# Altium project mach_sac_Project.PrjPcb
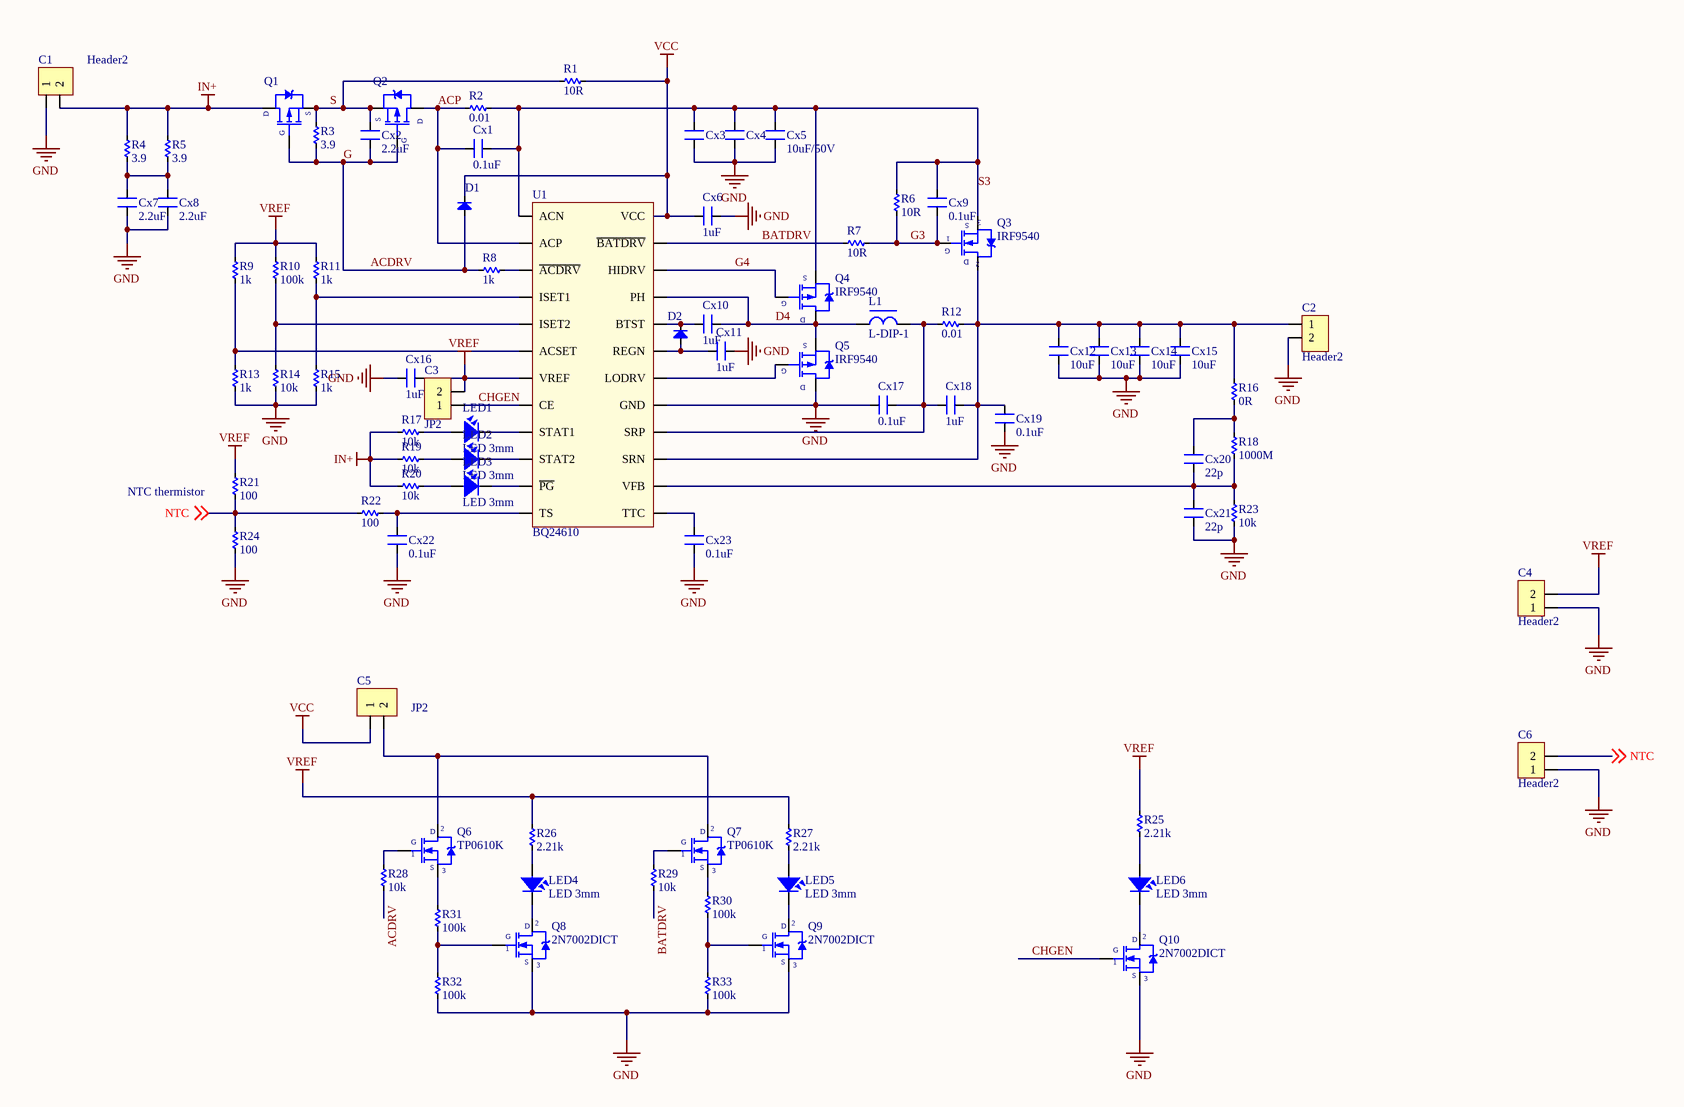
[diagram p0: mach sac.SchDoc]
1 sheet, 82 parts. Net scope: global (net labels, ports and power ports of the same name join across sheets).
Board file: mach sac.PcbDoc

## Sheet mach sac.SchDoc
size A3

### Parts
C1  Header2  [HDR2]
C2  Header2  [HDR2]
C3  JP2  [JP2-CLOSED]
C4  Header2  [HDR2]
C5  JP2  [JP2-C1T]
C6  Header2  [HDR2]
Cx1  0.1uF  [C0805]
Cx2  2.2uF  [C0805]
Cx3  10uF/50V  [C0805]  (value not drawn)
Cx4  10uF/50V  [C0805]  (value not drawn)
Cx5  10uF/50V  [C0805]
Cx6  1uF  [C0805]
Cx7  2.2uF  [C0805]
Cx8  2.2uF  [C0805]
Cx9  0.1uF  [C0805]
Cx10  1uF  [C0805]
Cx11  1uF  [C0805]
Cx12  10uF  [C0805]
Cx13  10uF  [C0805]
Cx14  10uF  [C0805]
Cx15  10uF  [C0805]
Cx16  1uF  [C0805]
Cx17  0.1uF  [C0805]
Cx18  1uF  [C0805]
Cx19  0.1uF  [C0805]
Cx20  22p  [C0805]
Cx21  22p  [C0805]
Cx22  0.1uF  [C0805]
Cx23  0.1uF  [C0805]
D1  Diode  [DIO-1A]  (value not drawn)
D2  Diode  [DIO-1A]  (value not drawn)
L1  L-DIP-1  [L-SMD-D-12.5x12.5]
LED1  LED 3mm  [Led SMD]
LED2  LED 3mm  [Led SMD]
LED3  LED 3mm  [Led SMD]
LED4  LED 3mm  [Led SMD]
LED5  LED 3mm  [Led SMD]
LED6  LED 3mm  [Led SMD]
Q1  IRF9540  [SO-8]  (value not drawn)
Q2  IRF9540  [SO-8]  (value not drawn)
Q3  IRF9540  [SO-8]
Q4  IRF9540  [SO-8]
Q5  IRF9540  [SO-8]
Q6  TP0610K  [SOT23-132]
Q7  TP0610K  [SOT23-132]
Q8  2N7002DICT  [SOT23-132]
Q9  2N7002DICT  [SOT23-132]
Q10  2N7002DICT  [SOT23-132]
R1  10R  [RES-SMD-0805]
R2  0.01  [RES-SMD-1210]
R3  3.9  [RES-SMD-0805]
R4  3.9  [RES-SMD-0805]
R5  3.9  [RES-SMD-0805]
R6  10R  [RES-SMD-0805]
R7  10R  [RES-SMD-0805]
R8  1k  [RES-SMD-0805]
R9  1k  [RES-SMD-0805]
R10  100k  [RES-SMD-0805]
R11  1k  [RES-SMD-0805]
R12  0.01  [RES-SMD-1210]
R13  1k  [RES-SMD-0805]
R14  10k  [RES-SMD-0805]
R15  1k  [RES-SMD-0805]
R16  0R  [RES-SMD-0805]
R17  10k  [RES-SMD-0805]
R18  1000M  [RES-SMD-0805]
R19  10k  [RES-SMD-0805]
R20  10k  [RES-SMD-0805]
R21  100  [RES-SMD-0805]
R22  100  [RES-SMD-0805]
R23  10k  [RES-SMD-0805]
R24  100  [RES-SMD-0805]
R25  2.21k  [RES-SMD-0603]
R26  2.21k  [RES-SMD-0603]
R27  2.21k  [RES-SMD-0603]
R28  10k  [RES-SMD-0603]
R29  10k  [RES-SMD-0603]
R30  100k  [RES-SMD-0603]
R31  100k  [RES-SMD-0603]
R32  100k  [RES-SMD-0603]
R33  100k  [RES-SMD-0603]
U1  BQ24610  [QFN50P400X400X100_HS-25N]

### Nets
GND: C1.1 C2.2 C4.1 C6.1 Cx3.2 Cx4.2 Cx5.2 Cx6.1 Cx7.1 Cx8.1 Cx11.1 Cx12.2 Cx13.2 Cx14.2 Cx15.2 Cx16.1 Cx17.2 Cx19.2 Cx21.2 Cx22.2 Cx23.2 Q5.2(D) Q8.3(S) Q9.3(S) Q10.3(S) R13.1 R14.1 R15.1 R23.2 R24.1 R32.2 R33.2 U1.17(GND)
IN+: C1.2 Q1.2(D) R4.1 R5.1 R17.2 R19.2 R20.2
VCC: C5.1 Cx6.2 D1.2(K) R1.2 U1.24(VCC)
VREF: C3.2 C4.2 Cx16.2 R9.2 R10.2 R11.2 R21.2 R25.1 R26.1 R27.1 U1.10(VREF)
ACDRV: Cx2.1 D1.1(A) Q1.1(G) Q2.1(G) R3.2 R8.1 R28.2  [also labelled G]
ACP: Cx1.2 Q2.2(D) R2.2 U1.2(ACP)
BATDRV: R7.1 R29.2 U1.23(~{BATDRV})
CHGEN: C3.1 Q10.1(G) U1.4(CE)
D4: Cx10.1 L1.1 Q4.2(D) Q5.3(S) U1.20(PH)
G3: Cx9.2 Q3.1(G) R6.1 R7.2
G4: Q4.1(G) U1.21(HIDRV)
NTC: C6.2 R21.1 R22.1 R24.2 ; off-sheet NTC
S: Cx2.2 Q1.3(S) Q2.3(S) R1.1 R3.1
S3: Cx1.1 Cx3.1 Cx4.1 Cx5.1 Cx9.1 Q3.3(S) Q4.3(S) R2.1 R6.2 U1.1(ACN)
NetC2_1: C2.1 Cx12.1 Cx13.1 Cx14.1 Cx15.1 Cx18.1 Cx19.1 Q3.2(D) R12.1 R16.1 U1.13(SRN)
NetC5_2: C5.2 Q6.2(D) Q7.2(D)
NetCx7_2: Cx7.2 Cx8.2 R4.2 R5.2
NetCx10_2: Cx10.2 D2.2(K) U1.22(BTST)
NetCx11_2: Cx11.2 D2.1(A) U1.18(REGN)
NetCx17_1: Cx17.1 Cx18.2 L1.2 R12.2 U1.14(SRP)
NetCx20_1: Cx20.1 R16.2 R18.1
NetCx20_2: Cx20.2 Cx21.1 R18.2 R23.1 U1.12(VFB)
NetCx22_1: Cx22.1 R22.2 U1.6(TS)
NetCx23_1: Cx23.1 U1.7(TTC)
NetLED1_1: LED1.1 R17.1
NetLED1_2: LED1.2 U1.5(STAT1)
NetLED2_1: LED2.1 R19.1
NetLED2_2: LED2.2 U1.9(STAT2)
NetLED3_1: LED3.1 R20.1
NetLED3_2: LED3.2 U1.8(~{PG})
NetLED4_1: LED4.1 R26.2
NetLED4_2: LED4.2 Q8.2(D)
NetLED5_1: LED5.1 R27.2
NetLED5_2: LED5.2 Q9.2(D)
NetLED6_1: LED6.1 R25.2
NetLED6_2: LED6.2 Q10.2(D)
NetQ5_1: Q5.1(G) U1.19(LODRV)
NetQ6_1: Q6.1(G) R28.1
NetQ6_3: Q6.3(S) R31.1
NetQ7_1: Q7.1(G) R29.1
NetQ7_3: Q7.3(S) R30.1
NetQ8_1: Q8.1(G) R31.2 R32.1
NetQ9_1: Q9.1(G) R30.2 R33.1
NetR8_2: R8.2 U1.3(~{ACDRV})
NetR9_1: R9.1 R13.2 U1.16(ACSET)
NetR10_1: R10.1 R14.2 U1.15(ISET2)
NetR11_1: R11.1 R15.2 U1.11(ISET1)

### Notes on the sheet
- (near R21) NTC thermistor

### Library data of the parts
C1 C2 C4 C6 = Header2: Header IDC, 2 x 1 Pin Vertical 2.54mm Pitch (Non-Boxed, Male); Manufacturer: W¨¹rth Elektronik eiSos GmbH; partNo: 613002143121; ComponentLink1 Description: Manufacturer; ComponentLink2 Description: Datasheet; NoPins: 02; Created Date: 29 March 2013; ComponentLink1URL: http://www.we-online.com; ComponentLink2URL: http://katalog.we-online.de/em/datasheet/6130xx143121.pdf; Created by: Karrer Zheng
C3 C5 = JP2: WR-PHD 2.54 mm Angled Socket Header; Manufacturer: W¨¹rth Elektronik eiSos GmbH; partNo: 613002143121; ComponentLink1 Description: Manufacturer; ComponentLink2 Description: Datasheet; NoPins: 02; Created Date: 29 March 2013; ComponentLink1URL: http://www.we-online.com; ComponentLink2URL: http://katalog.we-online.de/em/datasheet/6130xx143121.pdf; Created by: Karrer Zheng
Cx1-Cx23 = CN: Value: 33pF
D1 D2 = Diode: Default Diode; Code - JEDEC: DO-214-AB; Value: 1N5007; Published: 8-Jun-2000; Revision: July-2002: Re-released for DXP Platform.; Publisher: Altium Limited
L1 = L-DIP-1: Inductor; Value: 150 mH
LED1-LED6 = LED 3mm: LED Single colour Green and Red; Value: LED 3 ly Single Colour
Q1 = IRF9540: HEXFET P-Channel Power MOSFET; Note: Pin 2 is electrically connected to pin 4.; Published: 8-Jun-2000; LatestRevisionDate: 17-Jul-2002; LatestRevisionNote: Re-released for DXP Platform.; DatasheetVersion: PD-9.421C; PackageVersion: Feb-1997; PackageReference: TO-220AB; Publisher: Altium Limited; PackageDescription: TO, Thru-Hole, Vertical, Heatsink Mounted; 3 In-Line Leads; Pitch 2.54 mm; ComponentLink1Description: Manufacturer Link; ComponentLink1URL: http://www.irf.com/; ComponentLink2Description: Datasheet; ComponentLink2URL: http://www.irf.com/product-info/datasheets/data/irf9540.pdf
Q2 = IRF840: HEXFET P-Channel Power MOSFET; Note: Pin 2 is electrically connected to pin 4.; Published: 8-Jun-2000; LatestRevisionDate: 17-Jul-2002; LatestRevisionNote: Re-released for DXP Platform.; DatasheetVersion: PD-9.421C; PackageVersion: Feb-1997; PackageReference: TO-220AB; Publisher: Altium Limited; PackageDescription: TO, Thru-Hole, Vertical, Heatsink Mounted; 3 In-Line Leads; Pitch 2.54 mm; ComponentLink1Description: Manufacturer Link; ComponentLink1URL: http://www.irf.com/; ComponentLink2Description: Datasheet; ComponentLink2URL: http://www.irf.com/product-info/datasheets/data/irf9540.pdf
Q3 Q6-Q10 = IRF840: MOSFET N - CHANNEL 500V - 0.75 - 8A - TO-220; Value: IRF840
Q4 Q5 = IRF9540: HEXFET P-Channel Power MOSFET; Value: IRF840
R1-R33 = Res-SMD: Resistor; Manufacturer: Generic Components; Class: Passive; Published: 08/06/2000; Publisher: Altium Hobart Technology Centre
U1 = BQ24610: DIP24; Value: DIP24